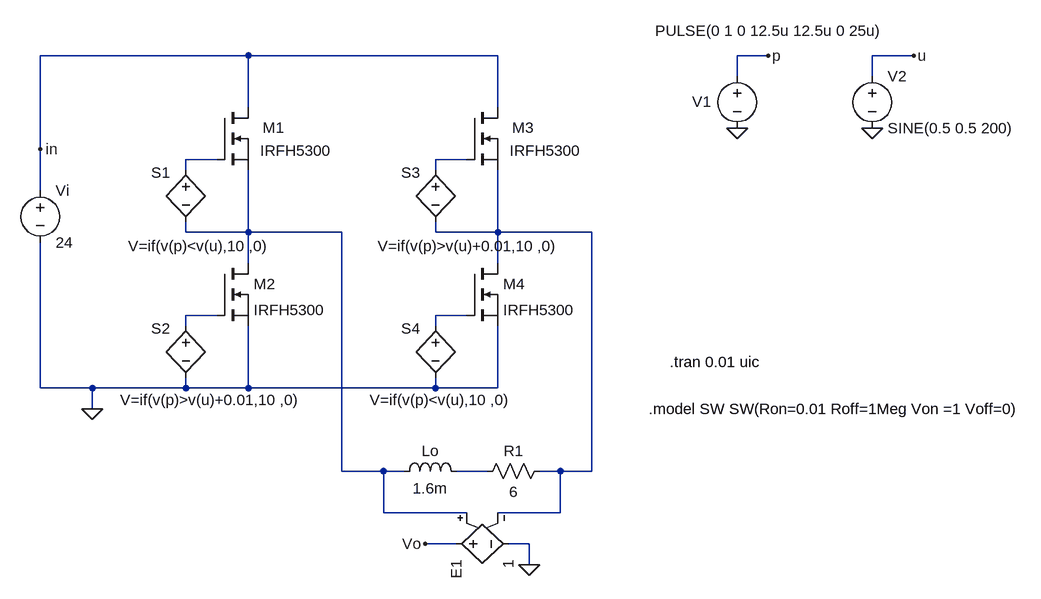
[diagram p0: schematic H-bridge.asc]
H-bridge.asc, the LTspice schematic file:
Version 4
SHEET 1 880 824
WIRE -1248 -320 -1568 -320
WIRE -864 -320 -1248 -320
WIRE -448 -320 -496 -320
WIRE -224 -320 -288 -320
WIRE -496 -288 -496 -320
WIRE -288 -288 -288 -320
WIRE -1248 -240 -1248 -320
WIRE -864 -240 -864 -320
WIRE -1568 -176 -1568 -320
WIRE -1296 -160 -1344 -160
WIRE -912 -160 -960 -160
WIRE -1344 -144 -1344 -160
WIRE -960 -144 -960 -160
WIRE -1568 -112 -1568 -176
WIRE -1344 -48 -1344 -64
WIRE -1248 -48 -1248 -144
WIRE -1248 -48 -1344 -48
WIRE -1104 -48 -1248 -48
WIRE -960 -48 -960 -64
WIRE -864 -48 -864 -144
WIRE -864 -48 -960 -48
WIRE -720 -48 -864 -48
WIRE -1248 0 -1248 -48
WIRE -864 0 -864 -48
WIRE -1296 80 -1344 80
WIRE -912 80 -960 80
WIRE -1344 96 -1344 80
WIRE -960 96 -960 80
WIRE -1568 192 -1568 -32
WIRE -1488 192 -1568 192
WIRE -1344 192 -1344 176
WIRE -1344 192 -1488 192
WIRE -1248 192 -1248 96
WIRE -1248 192 -1344 192
WIRE -960 192 -960 176
WIRE -960 192 -1248 192
WIRE -864 192 -864 96
WIRE -864 192 -960 192
WIRE -1488 224 -1488 192
WIRE -1104 320 -1104 -48
WIRE -1040 320 -1104 320
WIRE -1008 320 -1040 320
WIRE -880 320 -928 320
WIRE -768 320 -800 320
WIRE -720 320 -720 -48
WIRE -720 320 -768 320
WIRE -1040 384 -1040 320
WIRE -912 384 -1040 384
WIRE -768 384 -768 320
WIRE -768 384 -864 384
WIRE -928 432 -976 432
WIRE -816 432 -848 432
WIRE -816 464 -816 432
FLAG -1488 224 0
FLAG -496 -208 0
FLAG -448 -320 p
FLAG -288 -208 0
FLAG -224 -320 u
FLAG -1568 -176 in
FLAG -816 464 0
FLAG -976 432 Vo
SYMBOL ind -1024 336 R270
WINDOW 0 32 56 VTop 2
WINDOW 3 5 56 VBottom 2
SYMATTR InstName Lo
SYMATTR Value 1.6m
SYMBOL res -784 304 R90
WINDOW 0 0 56 VBottom 2
WINDOW 3 32 56 VTop 2
SYMATTR InstName R1
SYMATTR Value 6
SYMBOL voltage -1568 -128 R0
WINDOW 123 0 0 Left 2
WINDOW 39 0 0 Left 2
SYMATTR InstName Vi
SYMATTR Value 24
SYMBOL bv -1344 -160 R0
WINDOW 0 -53 20 Left 2
WINDOW 3 -89 133 Left 2
SYMATTR InstName S1
SYMATTR Value V=if(v(p)<v(u),10 ,0)
SYMBOL voltage -496 -304 R0
WINDOW 123 0 0 Left 2
WINDOW 39 0 0 Left 2
WINDOW 3 -126 -54 Left 2
WINDOW 0 -69 55 Left 2
SYMATTR Value PULSE(0 1 0 12.5u 12.5u 0 25u)
SYMATTR InstName V1
SYMBOL voltage -288 -304 R0
WINDOW 123 0 0 Left 2
WINDOW 39 0 0 Left 2
SYMATTR InstName V2
SYMATTR Value SINE(0.5 0.5 200)
SYMBOL nmos -1296 -240 R0
WINDOW 0 70 31 Left 2
WINDOW 3 66 66 Left 2
SYMATTR InstName M1
SYMATTR Value IRFH5300
SYMBOL nmos -1296 0 R0
SYMATTR InstName M2
SYMATTR Value IRFH5300
SYMBOL bv -1344 80 R0
WINDOW 0 -53 20 Left 2
WINDOW 3 -101 130 Left 2
SYMATTR InstName S2
SYMATTR Value V=if(v(p)>v(u)+0.01,10 ,0)
SYMBOL bv -960 -160 R0
WINDOW 0 -53 20 Left 2
WINDOW 3 -89 133 Left 2
SYMATTR InstName S3
SYMATTR Value V=if(v(p)>v(u)+0.01,10 ,0)
SYMBOL nmos -912 -240 R0
WINDOW 0 70 31 Left 2
WINDOW 3 66 66 Left 2
SYMATTR InstName M3
SYMATTR Value IRFH5300
SYMBOL nmos -912 0 R0
SYMATTR InstName M4
SYMATTR Value IRFH5300
SYMBOL bv -960 80 R0
WINDOW 0 -53 20 Left 2
WINDOW 3 -101 130 Left 2
SYMATTR InstName S4
SYMATTR Value V=if(v(p)<v(u),10 ,0)
SYMBOL e -944 432 M90
SYMATTR InstName E1
SYMATTR Value 1
TEXT -632 224 Left 2 !.model SW SW(Ron=0.01 Roff=1Meg Von =1 Voff=0)
TEXT -600 152 Left 2 !.tran 0.01 uic

The netlist it stands for:
* H-bridge.asc
Lo N003 N007 1.6m
R1 N004 N007 6
Vi in 0 24
B§S1 N001 N003 V=if(v(p)<v(u),10 ,0)
V1 p 0 PULSE(0 1 0 12.5u 12.5u 0 25u)
V2 u 0 SINE(0.5 0.5 200)
M1 in N001 N003 N003 IRFH5300
M2 N003 N005 0 0 IRFH5300
B§S2 N005 0 V=if(v(p)>v(u)+0.01,10 ,0)
B§S3 N002 N004 V=if(v(p)>v(u)+0.01,10 ,0)
M3 in N002 N004 N004 IRFH5300
M4 N004 N006 0 0 IRFH5300
B§S4 N006 0 V=if(v(p)<v(u),10 ,0)
E1 Vo 0 N003 N004 1
.model NMOS NMOS
.model PMOS PMOS
.lib standard.mos
.model SW SW(Ron=0.01 Roff=1Meg Von =1 Voff=0)
.tran 0.01 uic
.backanno
.end